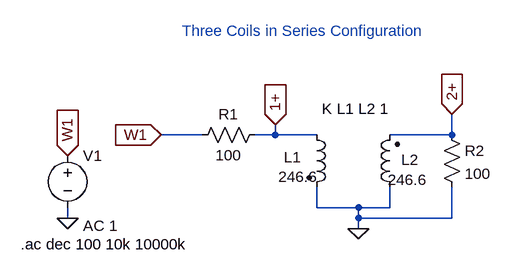
[diagram p0: schematic three_coils_ltspice.asc]
three_coils_ltspice.asc, the LTspice schematic file:
Version 4
SHEET 1 880 680
WIRE -48 64 -112 64
WIRE 64 64 64 48
WIRE 64 64 32 64
WIRE 128 64 64 64
WIRE 336 64 336 32
WIRE 336 64 240 64
WIRE 128 176 128 144
WIRE 192 176 128 176
WIRE 240 176 240 144
WIRE 240 176 192 176
WIRE -256 192 -256 176
WIRE 192 192 192 176
WIRE 336 192 336 144
WIRE 336 192 192 192
WIRE 192 208 192 192
FLAG 192 208 0
FLAG -112 64 W1
IOPIN -112 64 In
FLAG 336 32 2+
IOPIN 336 32 In
FLAG 64 48 1+
IOPIN 64 48 In
FLAG -256 192 0
FLAG -256 96 W1
IOPIN -256 96 In
SYMBOL ind2 112 48 R0
WINDOW 0 -35 50 Left 2
WINDOW 3 -43 80 Left 2
SYMATTR InstName L1
SYMATTR Value 246.6
SYMATTR Type ind
SYMBOL ind2 256 160 R180
WINDOW 0 -29 58 Left 2
WINDOW 3 -42 27 Left 2
SYMATTR InstName L2
SYMATTR Value 246.6
SYMATTR Type ind
SYMBOL res 48 48 R90
WINDOW 0 0 56 VBottom 2
WINDOW 3 32 56 VTop 2
SYMATTR InstName R1
SYMATTR Value 100
SYMBOL res 320 48 R0
SYMATTR InstName R2
SYMATTR Value 100
SYMBOL voltage -256 80 R0
WINDOW 123 24 124 Left 2
WINDOW 39 0 0 Left 0
SYMATTR InstName V1
SYMATTR Value ""
SYMATTR Value2 AC 1
TEXT -328 232 Left 2 !.ac dec 100 10k 10000k
TEXT 136 24 Left 2 !K L1 L2 1
TEXT -80 -96 Left 2 ;Three Coils in Series Configuration

The netlist it stands for:
* three_coils_ltspice.asc
L1 1+ 0 246.6
L2 0 2+ 246.6
R1 1+ W1 100
R2 2+ 0 100
V1 W1 0 AC 1
.ac dec 100 10k 10000k
K L1 L2 1
* Three Coils in Series Configuration
.backanno
.end